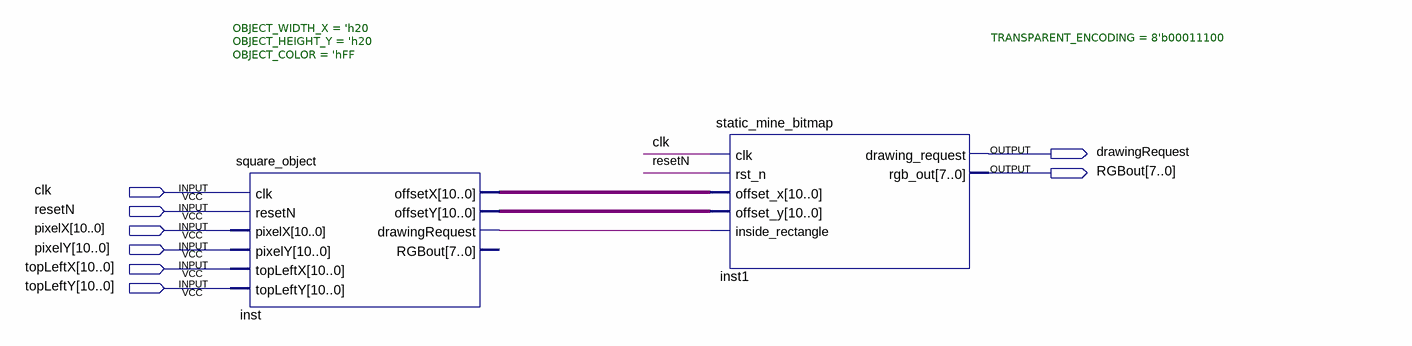
[diagram p0: schematic sheet]
// Quartus schematic static_mine_block.bdf as structural Verilog: 2 symbols, 8 pins
module static_mine_block (
  input  clk,
  input  resetN,
  input  [10:0] pixelX,
  input  [10:0] pixelY,
  input  [10:0] topLeftX,
  input  [10:0] topLeftY,
  output drawingRequest,
  output [7:0] RGBout
);

  wire inst_drawingrequest;
  wire [10:0] inst_offsetx, inst_offsety;

  square_object #(.OBJECT_WIDTH_X('h20), .OBJECT_HEIGHT_Y('h20), .OBJECT_COLOR('hFF)) inst (
    .clk(clk), .resetN(resetN), .pixelX(pixelX), .pixelY(pixelY), .topLeftX(topLeftX), .topLeftY(topLeftY),
    .offsetX(inst_offsetx), .offsetY(inst_offsety), .drawingRequest(inst_drawingrequest));  // open: RGBout
  static_mine_bitmap #(.TRANSPARENT_ENCODING(8'b00011100)) inst1 (
    .clk(clk), .rst_n(resetN), .offset_x(inst_offsetx), .offset_y(inst_offsety),
    .inside_rectangle(inst_drawingrequest), .drawing_request(drawingRequest), .rgb_out(RGBout));
endmodule
